# Altium schematic sheet periphery.SchDoc
size A4
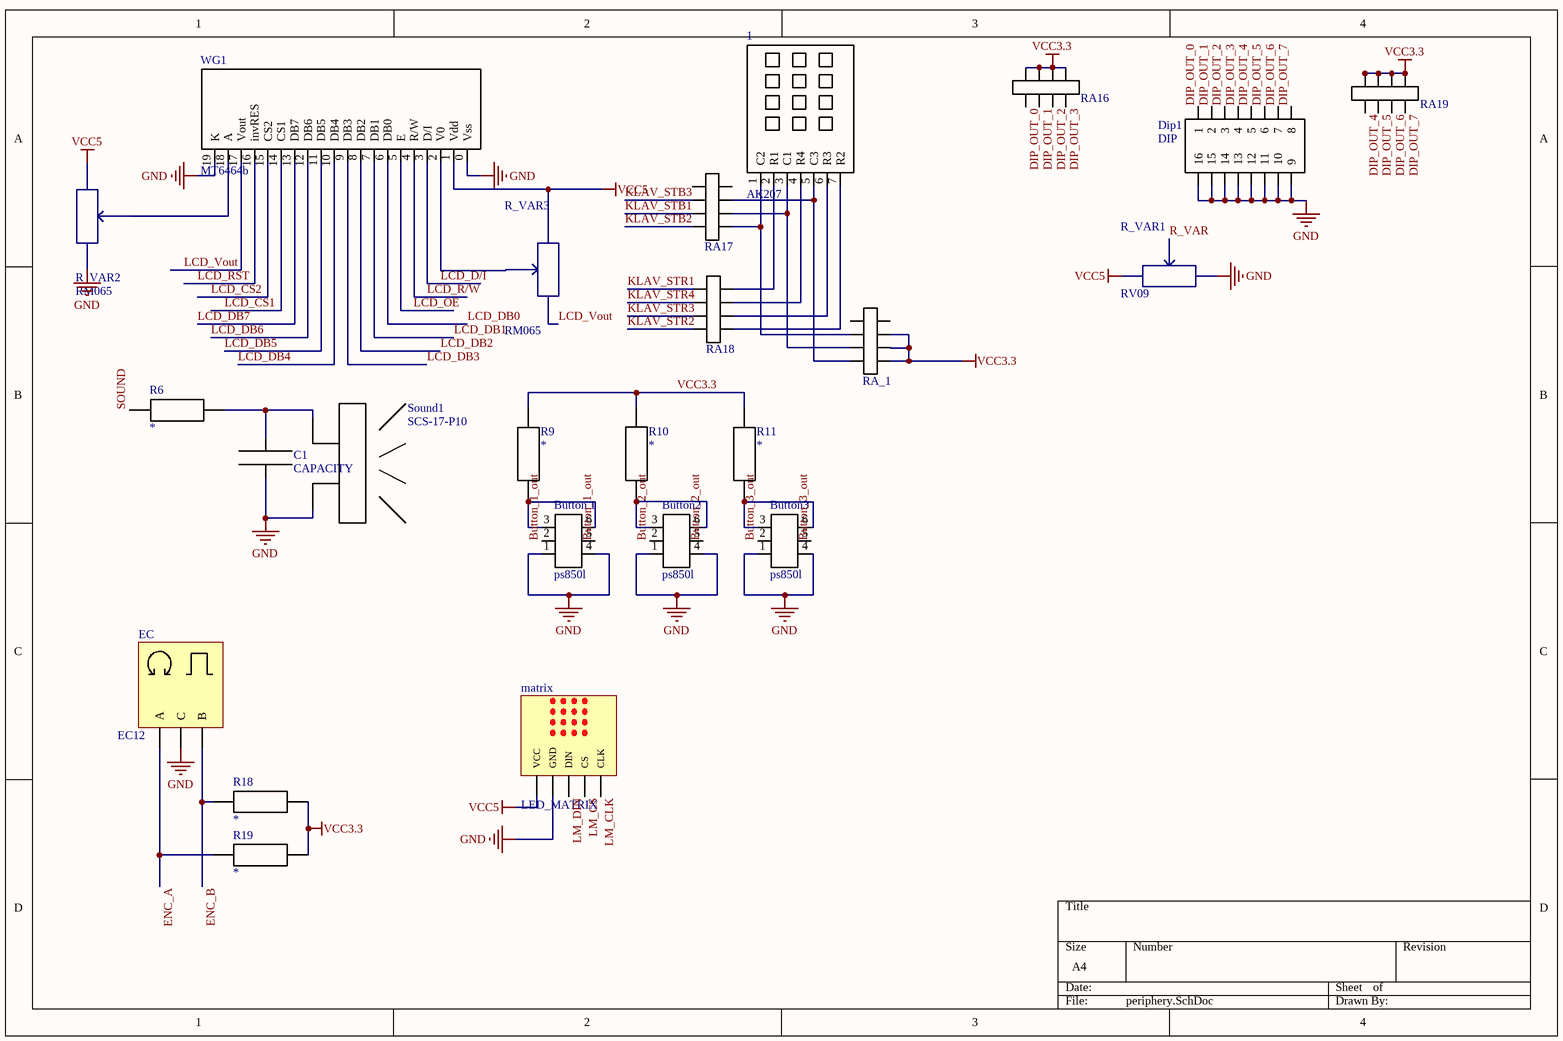
[diagram p0: periphery.SchDoc]

## Parts
1  AK207  [AK-207]
Button2  ps850l  [ps850l]
Button3  ps850l  [ps850l]
Button_1  ps850l  [ps850l]
C1  CAPACITY  [R0805]
Dip1  DIP  [SWD1-8]
EC  EC12  [EC]
matrix  LED_MATRIX  [LED_MATRIX]
R6  *  [R0805]
R9  *  [R0805]
R10  *  [R0805]
R11  *  [R0805]
R18  *  [R0805]
R19  *  [R0805]
R_VAR1  RV09  [RV09]
R_VAR2  RM065  [RM065]
R_VAR3  RM065  [RM065]
RA16  Bourns CAT16-102J4LF_1  [CAT16-102J4_NEW]  (value not drawn)
RA17  Bourns CAT16-102J4LF_1  [CAT16-102J4_NEW]  (value not drawn)
RA18  Bourns CAT16-102J4LF_1  [CAT16-102J4_NEW]  (value not drawn)
RA19  Bourns CAT16-102J4LF_1  [CAT16-102J4_NEW]  (value not drawn)
RA_1  Bourns CAT16-102J4LF_1  [CAT16-102J4_NEW]  (value not drawn)
Sound1  SCS-17-P10  [SCS-17-P10]
WG1  MT6464b  [WG12864A]

## Nets
GND: Button2.1 Button2.4 Button3.1 Button3.4 Button_1.1 Button_1.4 C1.1 Dip1.9 Dip1.10 Dip1.11 Dip1.12 Dip1.13 Dip1.14 Dip1.15 Dip1.16 EC.2(C) matrix.2(GND) R_VAR1.3 R_VAR2.3 Sound1.0 WG1.0(Vss) WG1.19(K)
VCC3.3: R9.1 R10.1 R11.1 R18.2 R19.2 RA16.0 RA16.1 RA16.2 RA16.3 RA19.0 RA19.1 RA19.2 RA19.3 RA_1.5 RA_1.6 RA_1.7
VCC5: matrix.1(VCC) R_VAR1.1 R_VAR2.1 R_VAR3.3 WG1.1(Vdd)
Button_1_out: Button_1.2 Button_1.5
Button_2_out: Button2.2 Button2.5
Button_3_out: Button3.2 Button3.5
DIP_OUT_0: Dip1.1 RA16.7
DIP_OUT_1: Dip1.2 RA16.6
DIP_OUT_2: Dip1.3 RA16.5
DIP_OUT_3: Dip1.4 RA16.4
DIP_OUT_4: Dip1.5 RA19.7
DIP_OUT_5: Dip1.6 RA19.6
DIP_OUT_6: Dip1.7 RA19.5
DIP_OUT_7: Dip1.8 RA19.4
ENC_A: EC.1(A) R19.1
ENC_B: EC.3(B) R18.1
KLAV_STB1: RA17.2
KLAV_STB2: RA17.3
KLAV_STB3: RA17.1
KLAV_STR1: RA18.0
KLAV_STR2: RA18.3
KLAV_STR3: RA18.2
KLAV_STR4: RA18.1
LCD_CS1: WG1.14(CS1)
LCD_CS2: WG1.15(CS2)
LCD_D/I: WG1.3(D/I)
LCD_DB0: WG1.6(DB0)
LCD_DB1: WG1.7(DB1)
LCD_DB2: WG1.8(DB2)
LCD_DB3: WG1.9(DB3)
LCD_DB4: WG1.10(DB4)
LCD_DB5: WG1.11(DB5)
LCD_DB6: WG1.12(DB6)
LCD_DB7: WG1.13(DB7)
LCD_OE: WG1.5(E)
LCD_R/W: WG1.4(R/W)
LCD_RST: WG1.16(invRES)
LCD_Vout: R_VAR3.1 WG1.17(Vout)
LM_CLK: matrix.5(CLK)
LM_CS: matrix.4(CS)
LM_DIN: matrix.3(DIN)
R_VAR: R_VAR1.2
SOUND: R6.1
Net1_1: 1.1(C2) RA17.4 RA_1.2
Net1_2: 1.2(R1) RA18.7
Net1_3: 1.3(C1) RA17.5 RA_1.1
Net1_4: 1.4(R4) RA18.6
Net1_5: 1.5(C3) RA17.6 RA_1.0
Net1_6: 1.6(R3) RA18.5
Net1_7: 1.7(R2) RA18.4
NetButton2_3: Button2.3 Button2.6 R10.2
NetButton3_3: Button3.3 Button3.6 R11.2
NetButton_1_3: Button_1.3 Button_1.6 R9.2
NetC1_2: C1.2 R6.2 Sound1.1
NetR_VAR2_2: R_VAR2.2 WG1.18(A)
NetR_VAR3_2: R_VAR3.2 WG1.2(V0)

Not connected (* = marked no-connect by the designer): RA17 0 7; RA_1 3 4

## Library data of the parts
1 = AK-207
EC = EC12: EC12 rotary encoder
matrix = LED_MATRIX: led matrix, max7219 driver
R6 R9-R11 R18 R19 = R0805: Resistance: *
R_VAR2 R_VAR3 = RM065: trimming potentiometer